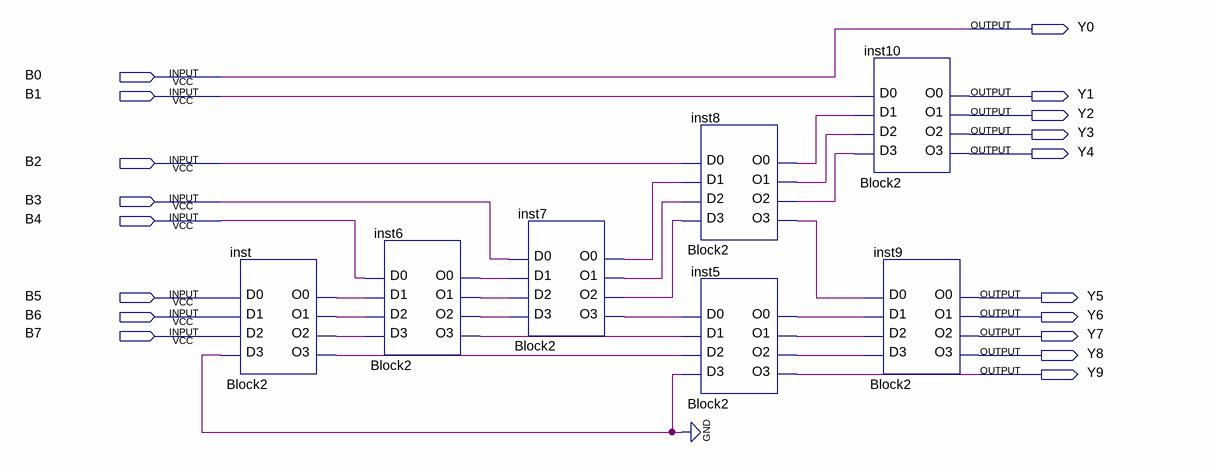
[diagram p0: schematic sheet]
// Quartus schematic binary_to_bcd_full.bdf as structural Verilog: 7 symbols, 18 pins
module binary_to_bcd_full (
  input  B0,
  input  B1,
  input  B2,
  input  B3,
  input  B4,
  input  B5,
  input  B6,
  input  B7,
  output Y0,
  output Y1,
  output Y2,
  output Y3,
  output Y4,
  output Y5,
  output Y6,
  output Y7,
  output Y8,
  output Y9
);

  wire inst5_o0, inst5_o1, inst5_o2, inst6_o0, inst6_o1, inst6_o2, inst6_o3, inst7_o0, inst7_o1, inst7_o2,
       inst7_o3, inst8_o0, inst8_o1, inst8_o2, inst8_o3, inst_o0, inst_o1, inst_o2, inst_o3;

  Block2 inst (.D3(1'b0), .D2(B7), .D1(B6), .D0(B5), .O3(inst_o3), .O2(inst_o2), .O1(inst_o1), .O0(inst_o0));
  Block2 inst6 (
    .D3(inst_o2), .D2(inst_o1), .D1(inst_o0), .D0(B4), .O3(inst6_o3), .O2(inst6_o2), .O1(inst6_o1),
    .O0(inst6_o0));
  Block2 inst7 (
    .D3(inst6_o2), .D2(inst6_o1), .D1(inst6_o0), .D0(B3), .O3(inst7_o3), .O2(inst7_o2), .O1(inst7_o1),
    .O0(inst7_o0));
  Block2 inst8 (
    .D3(inst7_o2), .D2(inst7_o1), .D1(inst7_o0), .D0(B2), .O3(inst8_o3), .O2(inst8_o2), .O1(inst8_o1),
    .O0(inst8_o0));
  Block2 inst5 (
    .D3(1'b0), .D2(inst_o3), .D1(inst6_o3), .D0(inst7_o3), .O3(Y9), .O2(inst5_o2), .O1(inst5_o1),
    .O0(inst5_o0));
  Block2 inst10 (.D3(inst8_o2), .D2(inst8_o1), .D1(inst8_o0), .D0(B1), .O3(Y4), .O2(Y3), .O1(Y2), .O0(Y1));
  Block2 inst9 (.D3(inst5_o2), .D2(inst5_o1), .D1(inst5_o0), .D0(inst8_o3), .O3(Y8), .O2(Y7), .O1(Y6), .O0(Y5));

  assign Y0 = B0;
endmodule
